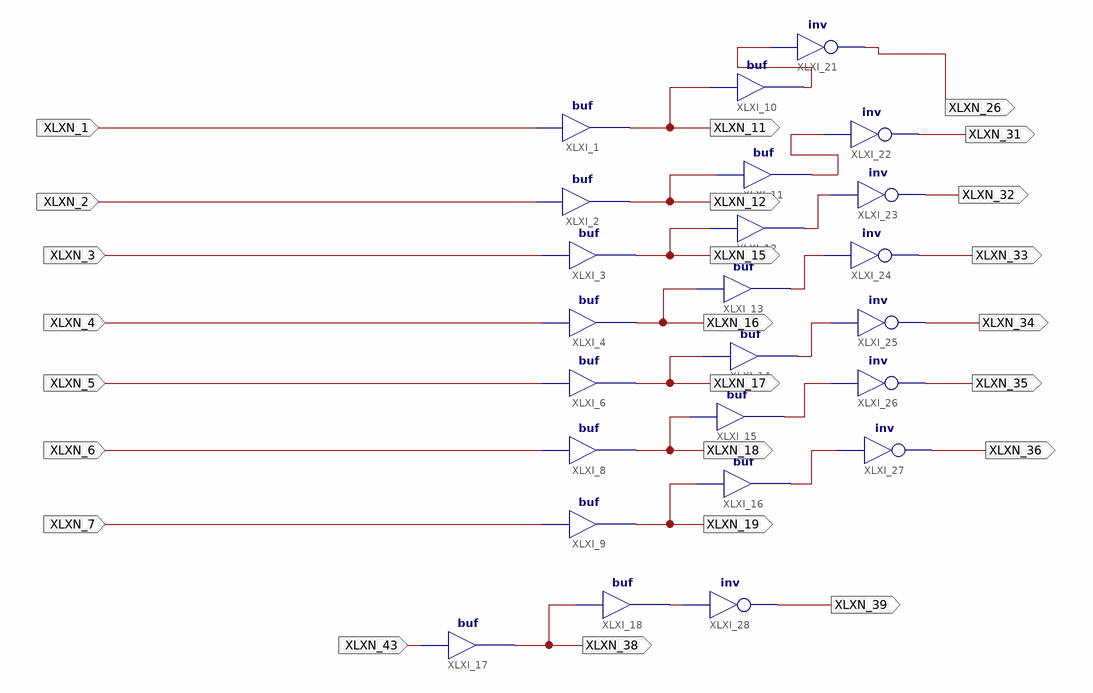
[diagram p0: schematic sheet 1]
// Xilinx ISE schematic labtest0.sch (spartan6) as structural Verilog: 24 symbols, 24 ports
module labtest0 (
  input  XLXN_1,
  input  XLXN_3,
  input  XLXN_4,
  input  XLXN_5,
  input  XLXN_6,
  input  XLXN_7,
  input  XLXN_2,
  input  XLXN_43,
  output XLXN_11,
  output XLXN_12,
  output XLXN_15,
  output XLXN_16,
  output XLXN_17,
  output XLXN_18,
  output XLXN_19,
  output XLXN_38,
  output XLXN_39,
  output XLXN_26,
  output XLXN_31,
  output XLXN_32,
  output XLXN_33,
  output XLXN_34,
  output XLXN_35,
  output XLXN_36
);

  wire XLXN_47, XLXN_60, XLXN_61, XLXN_62, XLXN_63, XLXN_64, XLXN_65, XLXN_66;

  buf XLXI_1 (XLXN_11, XLXN_1);
  buf XLXI_2 (XLXN_12, XLXN_2);
  buf XLXI_3 (XLXN_15, XLXN_3);
  buf XLXI_4 (XLXN_16, XLXN_4);
  buf XLXI_6 (XLXN_17, XLXN_5);
  buf XLXI_8 (XLXN_18, XLXN_6);
  buf XLXI_9 (XLXN_19, XLXN_7);
  buf XLXI_10 (XLXN_47, XLXN_11);
  buf XLXI_11 (XLXN_65, XLXN_12);
  buf XLXI_12 (XLXN_64, XLXN_15);
  buf XLXI_13 (XLXN_63, XLXN_16);
  buf XLXI_14 (XLXN_62, XLXN_17);
  buf XLXI_15 (XLXN_61, XLXN_18);
  buf XLXI_16 (XLXN_60, XLXN_19);
  buf XLXI_17 (XLXN_38, XLXN_43);
  buf XLXI_18 (XLXN_66, XLXN_38);
  not XLXI_21 (XLXN_26, XLXN_47);
  not XLXI_23 (XLXN_32, XLXN_64);
  not XLXI_24 (XLXN_33, XLXN_63);
  not XLXI_25 (XLXN_34, XLXN_62);
  not XLXI_26 (XLXN_35, XLXN_61);
  not XLXI_27 (XLXN_36, XLXN_60);
  not XLXI_28 (XLXN_39, XLXN_66);
  not XLXI_22 (XLXN_31, XLXN_65);
endmodule
